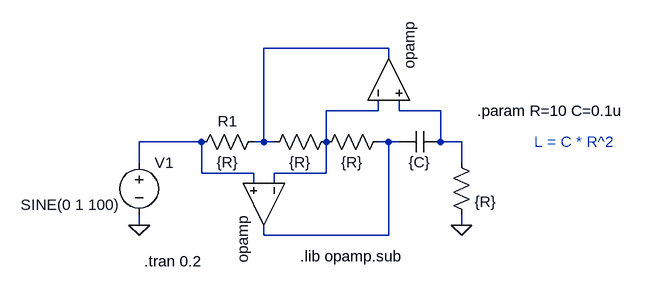
[diagram p0: schematic Antoniou_inductance_simulation.asc]
Antoniou_inductance_simulation.asc, the LTspice schematic file:
Version 4
SHEET 1 880 680
WIRE 336 -48 144 -48
WIRE 336 -32 336 -48
WIRE 320 48 320 32
WIRE 320 48 240 48
WIRE 352 48 352 32
WIRE 416 48 352 48
WIRE 48 96 -48 96
WIRE 144 96 144 -48
WIRE 144 96 128 96
WIRE 160 96 144 96
WIRE 240 96 240 48
WIRE 336 96 320 96
WIRE 352 96 336 96
WIRE 416 96 416 48
WIRE 448 96 416 96
WIRE -48 128 -48 96
WIRE 448 128 448 96
WIRE 48 144 48 96
WIRE 128 144 48 144
WIRE 240 144 240 96
WIRE 240 144 160 144
WIRE 128 160 128 144
WIRE 160 160 160 144
WIRE -48 224 -48 208
WIRE 448 224 448 208
WIRE 144 240 144 224
WIRE 336 240 336 96
WIRE 336 240 144 240
FLAG 448 224 0
FLAG -48 224 0
SYMBOL OpAmps\\opamp 208 192 R90
WINDOW 0 0 32 Invisible 2
SYMATTR InstName U1
SYMBOL res 32 112 R270
WINDOW 0 32 56 VTop 2
WINDOW 3 0 56 VBottom 2
SYMATTR InstName R1
SYMATTR Value {R}
SYMBOL res 256 80 R90
WINDOW 0 0 56 Invisible 2
WINDOW 3 32 56 VTop 2
SYMATTR InstName R2
SYMATTR Value {R}
SYMBOL res 336 80 R90
WINDOW 0 0 56 Invisible 2
WINDOW 3 32 56 VTop 2
SYMATTR InstName R3
SYMATTR Value {R}
SYMBOL OpAmps\\opamp 272 0 R270
WINDOW 0 0 32 Invisible 2
SYMATTR InstName U2
SYMBOL cap 416 80 R90
WINDOW 0 0 32 Invisible 2
WINDOW 3 32 32 VTop 2
SYMATTR InstName C4
SYMATTR Value {C}
SYMBOL res 432 112 R0
WINDOW 0 36 40 Invisible 2
SYMATTR InstName R5
SYMATTR Value {R}
SYMBOL voltage -48 112 R0
WINDOW 123 0 0 Left 0
WINDOW 39 0 0 Left 0
WINDOW 3 -182 81 Left 2
SYMATTR InstName V1
SYMATTR Value SINE(0 1 100)
TEXT -40 280 Left 2 !.tran 0.2
TEXT 200 272 Left 2 !.lib opamp.sub
TEXT 472 48 Left 2 !.param R=10 C=0.1u
TEXT 560 96 Left 2 ;L = C * R^2

The netlist it stands for:
* Antoniou_inductance_simulation.asc
XU1 N002 N004 N005 opamp Aol=100K GBW=10Meg  ; pins invin noninvin out
R1 N004 N001 {R}
R2 N002 N001 {R}
R3 N005 N002 {R}
XU2 N002 N003 N001 opamp Aol=100K GBW=10Meg  ; pins invin noninvin out
C4 N003 N005 {C}
R5 N003 0 {R}
V1 N004 0 SINE(0 1 100)
.tran 0.2
.lib opamp.sub
.param R=10 C=0.1u
* L = C * R^2
.backanno
.end